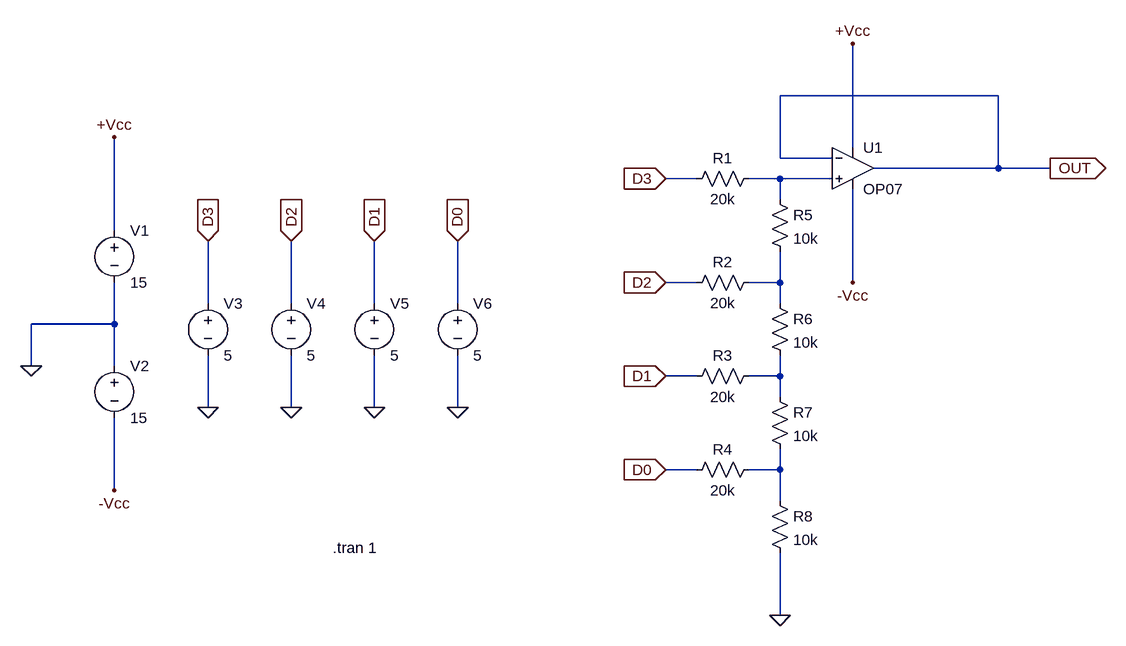
[diagram p0: schematic DAC_4bit.asc]
DAC_4bit.asc, the LTspice schematic file:
Version 4
SHEET 1 1388 680
WIRE 1200 -160 864 -160
WIRE 976 -80 976 -240
WIRE 864 -64 864 -160
WIRE 944 -64 864 -64
WIRE 1200 -48 1200 -160
WIRE 1200 -48 1008 -48
WIRE 1280 -48 1200 -48
WIRE 736 -32 688 -32
WIRE 864 -32 816 -32
WIRE 944 -32 864 -32
WIRE 864 0 864 -32
WIRE -160 48 -160 -96
WIRE 736 128 688 128
WIRE 864 128 864 80
WIRE 864 128 816 128
WIRE 976 128 976 -16
WIRE -16 160 -16 64
WIRE 112 160 112 64
WIRE 240 160 240 64
WIRE 368 160 368 64
WIRE 864 160 864 128
WIRE -160 192 -160 128
WIRE -160 192 -288 192
WIRE -288 256 -288 192
WIRE -160 256 -160 192
WIRE 736 272 688 272
WIRE 864 272 864 240
WIRE 864 272 816 272
WIRE 864 304 864 272
WIRE -16 320 -16 240
WIRE 112 320 112 240
WIRE 240 320 240 240
WIRE 368 320 368 240
WIRE 736 416 688 416
WIRE 864 416 864 384
WIRE 864 416 816 416
WIRE -160 448 -160 336
WIRE 864 464 864 416
WIRE 864 640 864 544
FLAG -288 256 0
FLAG -160 -96 +Vcc
FLAG -160 448 -Vcc
FLAG -16 320 0
FLAG 112 320 0
FLAG 240 320 0
FLAG 368 320 0
FLAG 976 -240 +Vcc
FLAG 976 128 -Vcc
FLAG 864 640 0
FLAG 368 64 D0
IOPIN 368 64 In
FLAG 688 416 D0
IOPIN 688 416 In
FLAG 240 64 D1
IOPIN 240 64 In
FLAG 688 272 D1
IOPIN 688 272 In
FLAG 112 64 D2
IOPIN 112 64 In
FLAG 688 128 D2
IOPIN 688 128 In
FLAG -16 64 D3
IOPIN -16 64 In
FLAG 688 -32 D3
IOPIN 688 -32 In
FLAG 1280 -48 OUT
IOPIN 1280 -48 Out
SYMBOL voltage -160 32 R0
SYMATTR InstName V1
SYMATTR Value 15
SYMBOL voltage -160 240 R0
SYMATTR InstName V2
SYMATTR Value 15
SYMBOL voltage -16 144 R0
SYMATTR InstName V3
SYMATTR Value 5
SYMBOL voltage 112 144 R0
SYMATTR InstName V4
SYMATTR Value 5
SYMBOL voltage 240 144 R0
SYMATTR InstName V5
SYMATTR Value 5
SYMBOL voltage 368 144 R0
SYMATTR InstName V6
SYMATTR Value 5
SYMBOL OpAmps\\OP07 976 -112 R0
SYMATTR InstName U1
SYMBOL res 832 -48 R90
WINDOW 0 0 56 VBottom 2
WINDOW 3 32 56 VTop 2
SYMATTR InstName R1
SYMATTR Value 20k
SYMBOL res 832 112 R90
WINDOW 0 0 56 VBottom 2
WINDOW 3 32 56 VTop 2
SYMATTR InstName R2
SYMATTR Value 20k
SYMBOL res 832 256 R90
WINDOW 0 0 56 VBottom 2
WINDOW 3 32 56 VTop 2
SYMATTR InstName R3
SYMATTR Value 20k
SYMBOL res 832 400 R90
WINDOW 0 0 56 VBottom 2
WINDOW 3 32 56 VTop 2
SYMATTR InstName R4
SYMATTR Value 20k
SYMBOL res 848 -16 R0
SYMATTR InstName R5
SYMATTR Value 10k
SYMBOL res 848 144 R0
SYMATTR InstName R6
SYMATTR Value 10k
SYMBOL res 848 288 R0
SYMATTR InstName R7
SYMATTR Value 10k
SYMBOL res 848 448 R0
SYMATTR InstName R8
SYMATTR Value 10k
TEXT 176 536 Left 2 !.tran 1

The netlist it stands for:
* DAC_4bit.asc
V1 +Vcc 0 15
V2 0 -Vcc 15
V3 D3 0 5
V4 D2 0 5
V5 D1 0 5
V6 D0 0 5
XU1 N001 OUT +Vcc -Vcc OUT LT1001  ; OP07, pins In+ In- V+ V- OUT
R1 N001 D3 20k
R2 N002 D2 20k
R3 N003 D1 20k
R4 N004 D0 20k
R5 N001 N002 10k
R6 N002 N003 10k
R7 N003 N004 10k
R8 N004 0 10k
.tran 1
.lib LTC.lib
.backanno
.end